# Altium schematic sheet spectrum_2kHz_250Hz.SchDoc
size A4; SheetNumber: 4; SheetTotal: 6
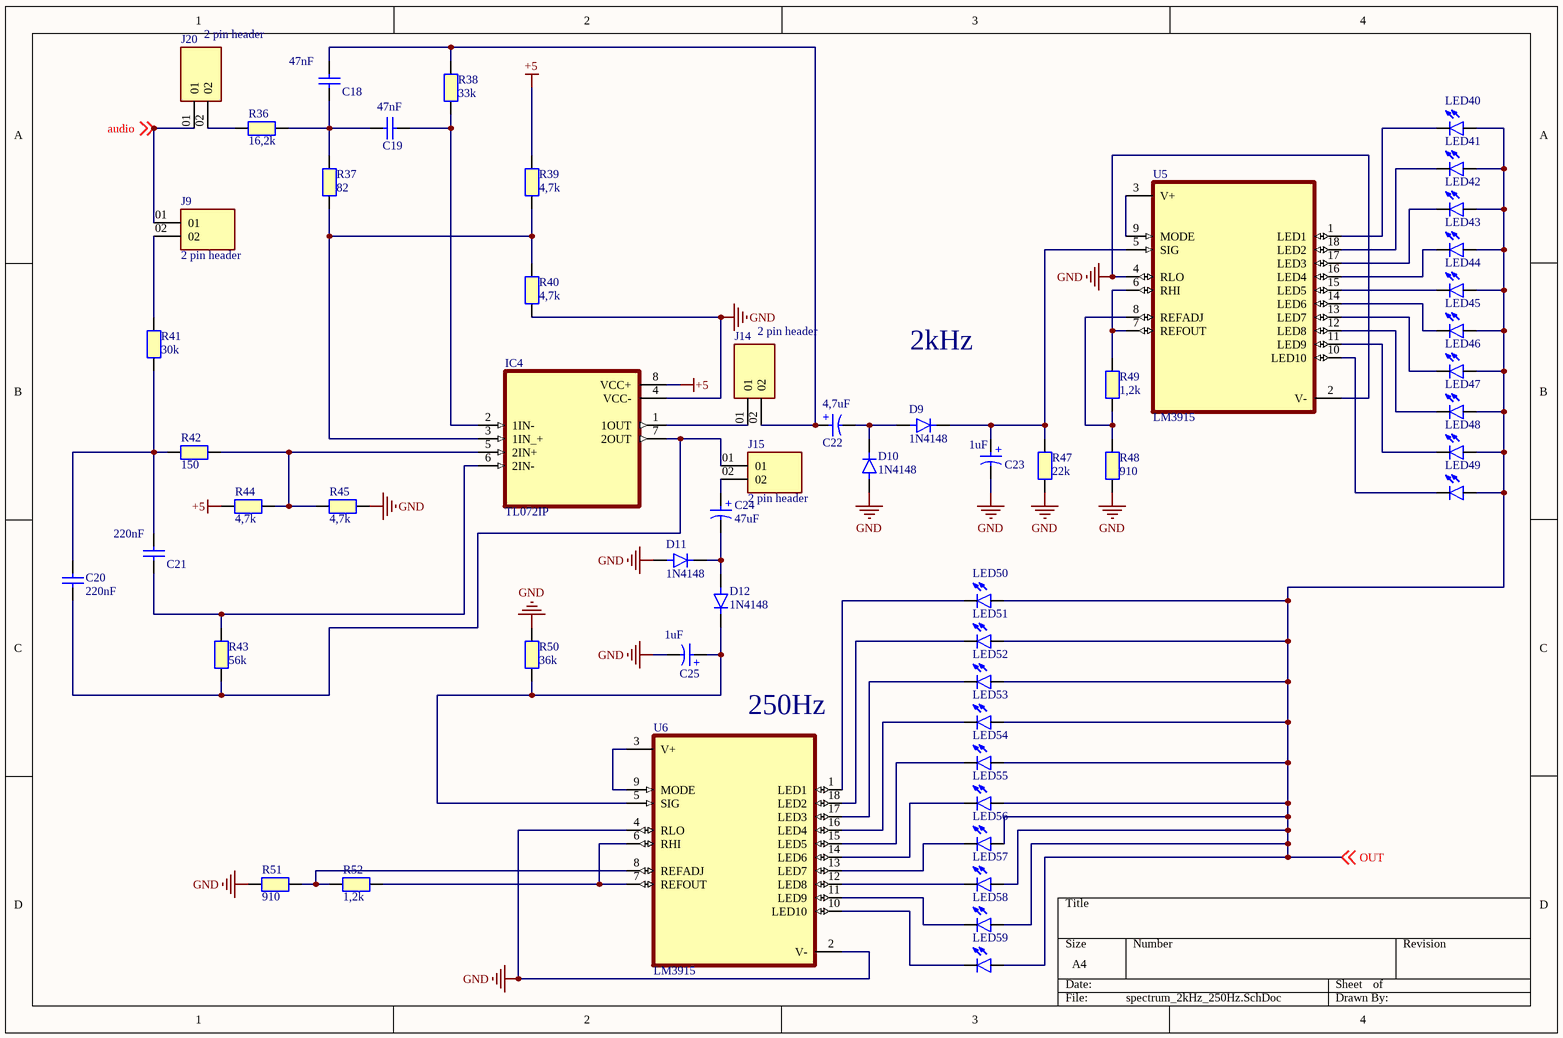
[diagram p0: spectrum_2kHz_250Hz.SchDoc]

## Parts
C18  47nF  [CAPC2012X65N]
C19  47nF  [CAPC2012X65N]
C20  220nF  [CAPC2012X65N]
C21  220nF  [CAPC2012X65N]
C22  4,7uF  [WCAP-ATG8_D5H11]
C23  1uF  [WCAP-ATG8_D5H11]
C24  47uF  [WCAP-ATG8_D5H11]
C25  1uF  [WCAP-ATG8_D5H11]
D9  1N4148  [DIOAD829W49L456D191]
D10  1N4148  [DIOAD829W49L456D191]
D11  1N4148  [DIOAD829W49L456D191]
D12  1N4148  [DIOAD829W49L456D191]
IC4  TL072IP  [DIP794W45P254L959H508Q8]
J9  2 pin header  [SAMTEC_HTSW-102-07-TM-S]
J14  2 pin header  [SAMTEC_HTSW-102-07-TM-S]
J15  2 pin header  [SAMTEC_HTSW-102-07-TM-S]
J20  2 pin header  [SAMTEC_HTSW-102-07-TM-S]
LED40  LED 2x3x4  [LED 2x3x4mm]  (value not drawn)
LED41  LED 2x3x4  [LED 2x3x4mm]  (value not drawn)
LED42  LED 2x3x4  [LED 2x3x4mm]  (value not drawn)
LED43  LED 2x3x4  [LED 2x3x4mm]  (value not drawn)
LED44  LED 2x3x4  [LED 2x3x4mm]  (value not drawn)
LED45  LED 2x3x4  [LED 2x3x4mm]  (value not drawn)
LED46  LED 2x3x4  [LED 2x3x4mm]  (value not drawn)
LED47  LED 2x3x4  [LED 2x3x4mm]  (value not drawn)
LED48  LED 2x3x4  [LED 2x3x4mm]  (value not drawn)
LED49  LED 2x3x4  [LED 2x3x4mm]  (value not drawn)
LED50  LED 2x3x4  [LED 2x3x4mm]  (value not drawn)
LED51  LED 2x3x4  [LED 2x3x4mm]  (value not drawn)
LED52  LED 2x3x4  [LED 2x3x4mm]  (value not drawn)
LED53  LED 2x3x4  [LED 2x3x4mm]  (value not drawn)
LED54  LED 2x3x4  [LED 2x3x4mm]  (value not drawn)
LED55  LED 2x3x4  [LED 2x3x4mm]  (value not drawn)
LED56  LED 2x3x4  [LED 2x3x4mm]  (value not drawn)
LED57  LED 2x3x4  [LED 2x3x4mm]  (value not drawn)
LED58  LED 2x3x4  [LED 2x3x4mm]  (value not drawn)
LED59  LED 2x3x4  [LED 2x3x4mm]  (value not drawn)
R36  16,2k  [RESC2012X50N]
R37  82  [RESC2012X50N]
R38  33k  [RESC2012X50N]
R39  4,7k  [RESC2012X50N]
R40  4,7k  [RESC2012X50N]
R41  30k  [RESC2012X50N]
R42  150  [RESC2012X50N]
R43  56k  [RESC2012X50N]
R44  4,7k  [RESC2012X50N]
R45  4,7k  [RESC2012X50N]
R47  22k  [RESC2012X50N]
R48  910  [RESC2012X50N]
R49  1,2k  [RESC2012X50N]
R50  36k  [RESC2012X50N]
R51  910  [RESC2012X50N]
R52  1,2k  [RESC2012X50N]
U5  LM3915  [DIP952W45P254L2336H533Q18]
U6  LM3915  [DIP952W45P254L2336H533Q18]

## Nets
+5: IC4.8(VCC+) R39.2 R44.2
GND: C23.2(N) C25.2(N) D10.A D11.A IC4.4(VCC-) R40.1 R45.2 R47.1 R48.2 R50.1 R51.2 U5.2(V-) U5.4(RLO) U6.2(V-) U6.4(RLO)
audio: J9.01 J20.01 ; off-sheet audio
OUT: LED40.A LED41.A LED42.A LED43.A LED44.A LED45.A LED46.A LED47.A LED48.A LED49.A LED50.A LED51.A LED52.A LED53.A LED54.A LED55.A LED56.A LED57.A LED58.A LED59.A ; off-sheet OUT
NetC18_1: C18.1 C19.1 R36.2 R37.2
NetC18_2: C18.2 C22.1(P) J14.02 R38.2
NetC19_2: C19.2 IC4.2(1IN-) R38.1
NetC20_1: C20.1 IC4.7(2OUT) J15.01 R43.1
NetC20_2: C20.2 C21.2 R41.1 R42.2
NetC21_1: C21.1 IC4.6(2IN-) R43.2
NetC22_2: C22.2(N) D9.A D10.C
NetC23_1: C23.1(P) D9.C R47.2 U5.5(SIG)
NetC24_1: C24.1(P) J15.02
NetC24_2: C24.2(N) D11.C D12.A
NetC25_1: C25.1(P) D12.C R50.2 U6.5(SIG)
NetIC4_1: IC4.1(1OUT) J14.01
NetIC4_3: IC4.3(1IN_+) R37.1 R39.1 R40.2
NetIC4_5: IC4.5(2IN+) R42.1 R44.1 R45.1
NetJ9_02: J9.02 R41.2
NetJ20_02: J20.02 R36.1
NetLED40_K: LED40.K(C) U5.1(LED1)
NetLED41_K: LED41.K(C) U5.18(LED2)
NetLED42_K: LED42.K(C) U5.17(LED3)
NetLED43_K: LED43.K(C) U5.16(LED4)
NetLED44_K: LED44.K(C) U5.15(LED5)
NetLED45_K: LED45.K(C) U5.14(LED6)
NetLED46_K: LED46.K(C) U5.13(LED7)
NetLED47_K: LED47.K(C) U5.12(LED8)
NetLED48_K: LED48.K(C) U5.11(LED9)
NetLED49_K: LED49.K(C) U5.10(LED10)
NetLED50_K: LED50.K(C) U6.1(LED1)
NetLED51_K: LED51.K(C) U6.18(LED2)
NetLED52_K: LED52.K(C) U6.17(LED3)
NetLED53_K: LED53.K(C) U6.16(LED4)
NetLED54_K: LED54.K(C) U6.15(LED5)
NetLED55_K: LED55.K(C) U6.14(LED6)
NetLED56_K: LED56.K(C) U6.13(LED7)
NetLED57_K: LED57.K(C) U6.12(LED8)
NetLED58_K: LED58.K(C) U6.11(LED9)
NetLED59_K: LED59.K(C) U6.10(LED10)
NetR48_1: R48.1 R49.2 U5.8(REFADJ)
NetR49_1: R49.1 U5.6(RHI) U5.7(REFOUT)
NetR51_1: R51.1 R52.2 U6.8(REFADJ)
NetR52_1: R52.1 U6.6(RHI) U6.7(REFOUT)
NetU5_3: U5.3(V+) U5.9(MODE)
NetU6_3: U6.3(V+) U6.9(MODE)

## Notes on the sheet
- 2kHz
- (near U6) 250Hz
- (in symbol 860010272005) +

## Library data of the parts
C18 C19 = 885012004008: 47nF ceramic; Manufacturer: Wurth Elektronik; Match Code: WCAP-CSGP; Case/Size Code: 0201; Capacitance: 22pF; Capacitance Tolerance: +/-5%; Ceramic Type: NP0 Class I; Insulation Resistance: 10GΩ; Q Factor: 840; Rated Voltage (DC): 25V; Technical Reference: NP00201220J025DFCT10000; Manufacturer Part Number: 885012004008; Category: Multilayer Ceramic Chip Capacitors; ComponentLink1Description: Website Link; ComponentLink1URL: https://www.we-online.com/redexpert/article/885012004008?ad; ComponentLink2Description: Datasheet Link; ComponentLink2URL: https://www.we-online.com/redexpert/spec/885012004008?ad; Mount: Surface Mount; Operating Temperature Max: 125°C; Operating Temperature Min: -55°C; Packaging: Tape and Reel; Length: 0.6mm; Width: 0.3mm; Height: 0.3mm
C20 C21 = 885012004008: 220nF ceramic; Manufacturer: Wurth Elektronik; Match Code: WCAP-CSGP; Case/Size Code: 0201; Capacitance: 22pF; Capacitance Tolerance: +/-5%; Ceramic Type: NP0 Class I; Insulation Resistance: 10GΩ; Q Factor: 840; Rated Voltage (DC): 25V; Technical Reference: NP00201220J025DFCT10000; Manufacturer Part Number: 885012004008; Category: Multilayer Ceramic Chip Capacitors; ComponentLink1Description: Website Link; ComponentLink1URL: https://www.we-online.com/redexpert/article/885012004008?ad; ComponentLink2Description: Datasheet Link; ComponentLink2URL: https://www.we-online.com/redexpert/spec/885012004008?ad; Mount: Surface Mount; Operating Temperature Max: 125°C; Operating Temperature Min: -55°C; Packaging: Tape and Reel; Length: 0.6mm; Width: 0.3mm; Height: 0.3mm
C22 = 860010272005: Elco 4,7uF; Manufacturer: Wurth Elektronik; Match Code: WCAP-ATG8; Capacitance: 100µF; Capacitance Tolerance: +/-20%; Dissipation Factor: 19%; Endurance: 2000h; Leakage Current: 10µA; Rated Voltage (DC): 10V; Ripple Current: 198mA; Technical Reference: ATBC110101M010DSPA3B000; Manufacturer Part Number: 860010272005; Category: Aluminum Electrolytic Capacitors; ComponentLink1Description: Website Link; ComponentLink1URL: https://www.we-online.com/redexpert/article/860010272005?ad; ComponentLink2Description: Datasheet Link; ComponentLink2URL: https://www.we-online.com/redexpert/spec/860010272005?ad; Mount: Through Hole; Operating Temperature Max: 85°C; Operating Temperature Min: -40°C; Packaging: Ammo Pack; Height: 11mm; Diameter: 5mm
C23 = 860010272005: WCAP-ATG8 Aluminum Electrolytic Capacitor, Radial, THT, D5 x H11mm, 1uF, 10V; Manufacturer: Wurth Elektronik; Capacitance: 100µF; Capacitance Tolerance: +/-20%; Dissipation Factor: 19%; Endurance: 2000h; Leakage Current: 10µA; Ripple Current: 198mA; Technical Reference: ATBC110101M010DSPA3B000; Manufacturer Part Number: 860010272005; Category: Aluminum Electrolytic Capacitors; Match Code: WCAP-ATG8; ComponentLink1Description: Website Link; ComponentLink1URL: https://www.we-online.com/redexpert/article/860010272005?ad; ComponentLink2Description: Datasheet Link; ComponentLink2URL: https://www.we-online.com/redexpert/spec/860010272005?ad; Mount: Through Hole; Operating Temperature Max: 85°C; Operating Temperature Min: -40°C; Packaging: Ammo Pack; Height: 11mm; Diameter: 5mm; Rated Voltage (DC): 10V
C24 = 860010272005: Elco 47uF; Manufacturer: Wurth Elektronik; Match Code: WCAP-ATG8; Capacitance: 100µF; Capacitance Tolerance: +/-20%; Dissipation Factor: 19%; Endurance: 2000h; Leakage Current: 10µA; Rated Voltage (DC): 10V; Ripple Current: 198mA; Technical Reference: ATBC110101M010DSPA3B000; Manufacturer Part Number: 860010272005; Category: Aluminum Electrolytic Capacitors; ComponentLink1Description: Website Link; ComponentLink1URL: https://www.we-online.com/redexpert/article/860010272005?ad; ComponentLink2Description: Datasheet Link; ComponentLink2URL: https://www.we-online.com/redexpert/spec/860010272005?ad; Mount: Through Hole; Operating Temperature Max: 85°C; Operating Temperature Min: -40°C; Packaging: Ammo Pack; Height: 11mm; Diameter: 5mm
C25 = 860010272005: WCAP-ATG8 Aluminum Electrolytic Capacitor, Radial, THT, D5 x H11mm, 1µF, 10V; Manufacturer: Wurth Elektronik; Capacitance: 100µF; Capacitance Tolerance: +/-20%; Dissipation Factor: 19%; Endurance: 2000h; Leakage Current: 10µA; Ripple Current: 198mA; Technical Reference: ATBC110101M010DSPA3B000; Manufacturer Part Number: 860010272005; Category: Aluminum Electrolytic Capacitors; Match Code: WCAP-ATG8; ComponentLink1Description: Website Link; ComponentLink1URL: https://www.we-online.com/redexpert/article/860010272005?ad; ComponentLink2Description: Datasheet Link; ComponentLink2URL: https://www.we-online.com/redexpert/spec/860010272005?ad; Mount: Through Hole; Operating Temperature Max: 85°C; Operating Temperature Min: -40°C; Packaging: Ammo Pack; Height: 11mm; Diameter: 5mm; Rated Voltage (DC): 10V
D9-D12 = 1N4148: Diode Standard 75V 200mA Surface Mount SOD-523F; MF: ON Semiconductor; Price: None; Availability: In Stock; Package: AXIAL LEAD-2 ON Semiconductor; MP: 1N4148; Value: *; SnapEDA_Link: https://www.snapeda.com/parts/1N4148/Onsemi/view-part/?ref=snap; Purchase-URL: https://pricing.snapeda.com/search/part/1N4148/?ref=eda; Check_prices: https://www.snapeda.com/parts/1N4148/Onsemi/view-part/?ref=eda
IC4 = TL072IP: Dual, 30-V, 3-MHz, high slew rate (13-V/Âµs), In to V+, JFET-input op amp; MF: Texas Instruments; Price: None; Package: PDIP-8 Texas; Purchase-URL: https://pricing.snapeda.com/search/part/TL072IP/?ref=eda; Availability: In Stock; SnapEDA_Link: https://www.snapeda.com/parts/TL072IP/Texas+Instruments/view-part/?ref=snap; Value: *; MP: TL072IP; Check_prices: https://www.snapeda.com/parts/TL072IP/Texas+Instruments/view-part/?ref=eda
J9 J14 J15 J20 = 2 pin header: 2 pin header Jumper; MP: HTSW10207TMS; MF: Samtec; SnapEDA_Link: https://www.snapeda.com/parts/HTSW10207TMS/Samtec/view-part/?ref=snap; Value: *; Purchase-URL: https://pricing.snapeda.com/search/part/HTSW10207TMS/?ref=eda; Availability: In Stock; Check_prices: https://www.snapeda.com/parts/HTSW10207TMS/Samtec/view-part/?ref=eda; Package: None; Price: None
LED40-LED59 = LED 2x3x4: Green 569nm LED Indication - Discrete 1.9V Radial; MP: TLLG4400; MF: Vishay Semiconductors; SnapEDA_Link: https://www.snapeda.com/parts/TLLG4400/Vishay/view-part/?ref=snap; Availability: In Stock; Package: None; Check_prices: https://www.snapeda.com/parts/TLLG4400/Vishay/view-part/?ref=eda; Value: *; Purchase-URL: https://pricing.snapeda.com/search/part/TLLG4400/?ref=eda; Price: None
R36 = RESISTOR 0805: 16.2k Resistor 0805; Part Number: TNPW080510K0BETA; Manufacturer: Vishay Dale
R37 = RESISTOR 0805: 82Ohm Resistor 0805; Part Number: TNPW080510K0BETA; Manufacturer: Vishay Dale
R38 = RESISTOR 0805: 33k Resistor 0805; Part Number: TNPW080510K0BETA; Manufacturer: Vishay Dale
R39 R40 R44 R45 R50 = RESISTOR 0805: 4,7k Resistor 0805; Part Number: TNPW080510K0BETA; Manufacturer: Vishay Dale
R41 = RESISTOR 0805: 30k Resistor 0805; Part Number: TNPW080510K0BETA; Manufacturer: Vishay Dale
R42 = RESISTOR 0805: 150 Resistor 0805; Part Number: TNPW080510K0BETA; Manufacturer: Vishay Dale
R43 = RESISTOR 0805: 56k Resistor 0805; Part Number: TNPW080510K0BETA; Manufacturer: Vishay Dale
R47 = RESISTOR 0805: 22k Resistor 0805; Part Number: TNPW080510K0BETA; Manufacturer: Vishay Dale
R48 R51 = RESISTOR 0805: 910 Resistor 0805; Part Number: TNPW080510K0BETA; Manufacturer: Vishay Dale
R49 R52 = RESISTOR 0805: 1,2k Resistor 0805; Part Number: TNPW080510K0BETA; Manufacturer: Vishay Dale
U5 U6 = LM3915: MP: LM3914N-1; Package: None; Availability: Unavailable; Price: None; Value: *